# Altium schematic sheet PrimaryConverterSch-draft.SchDoc
size A3
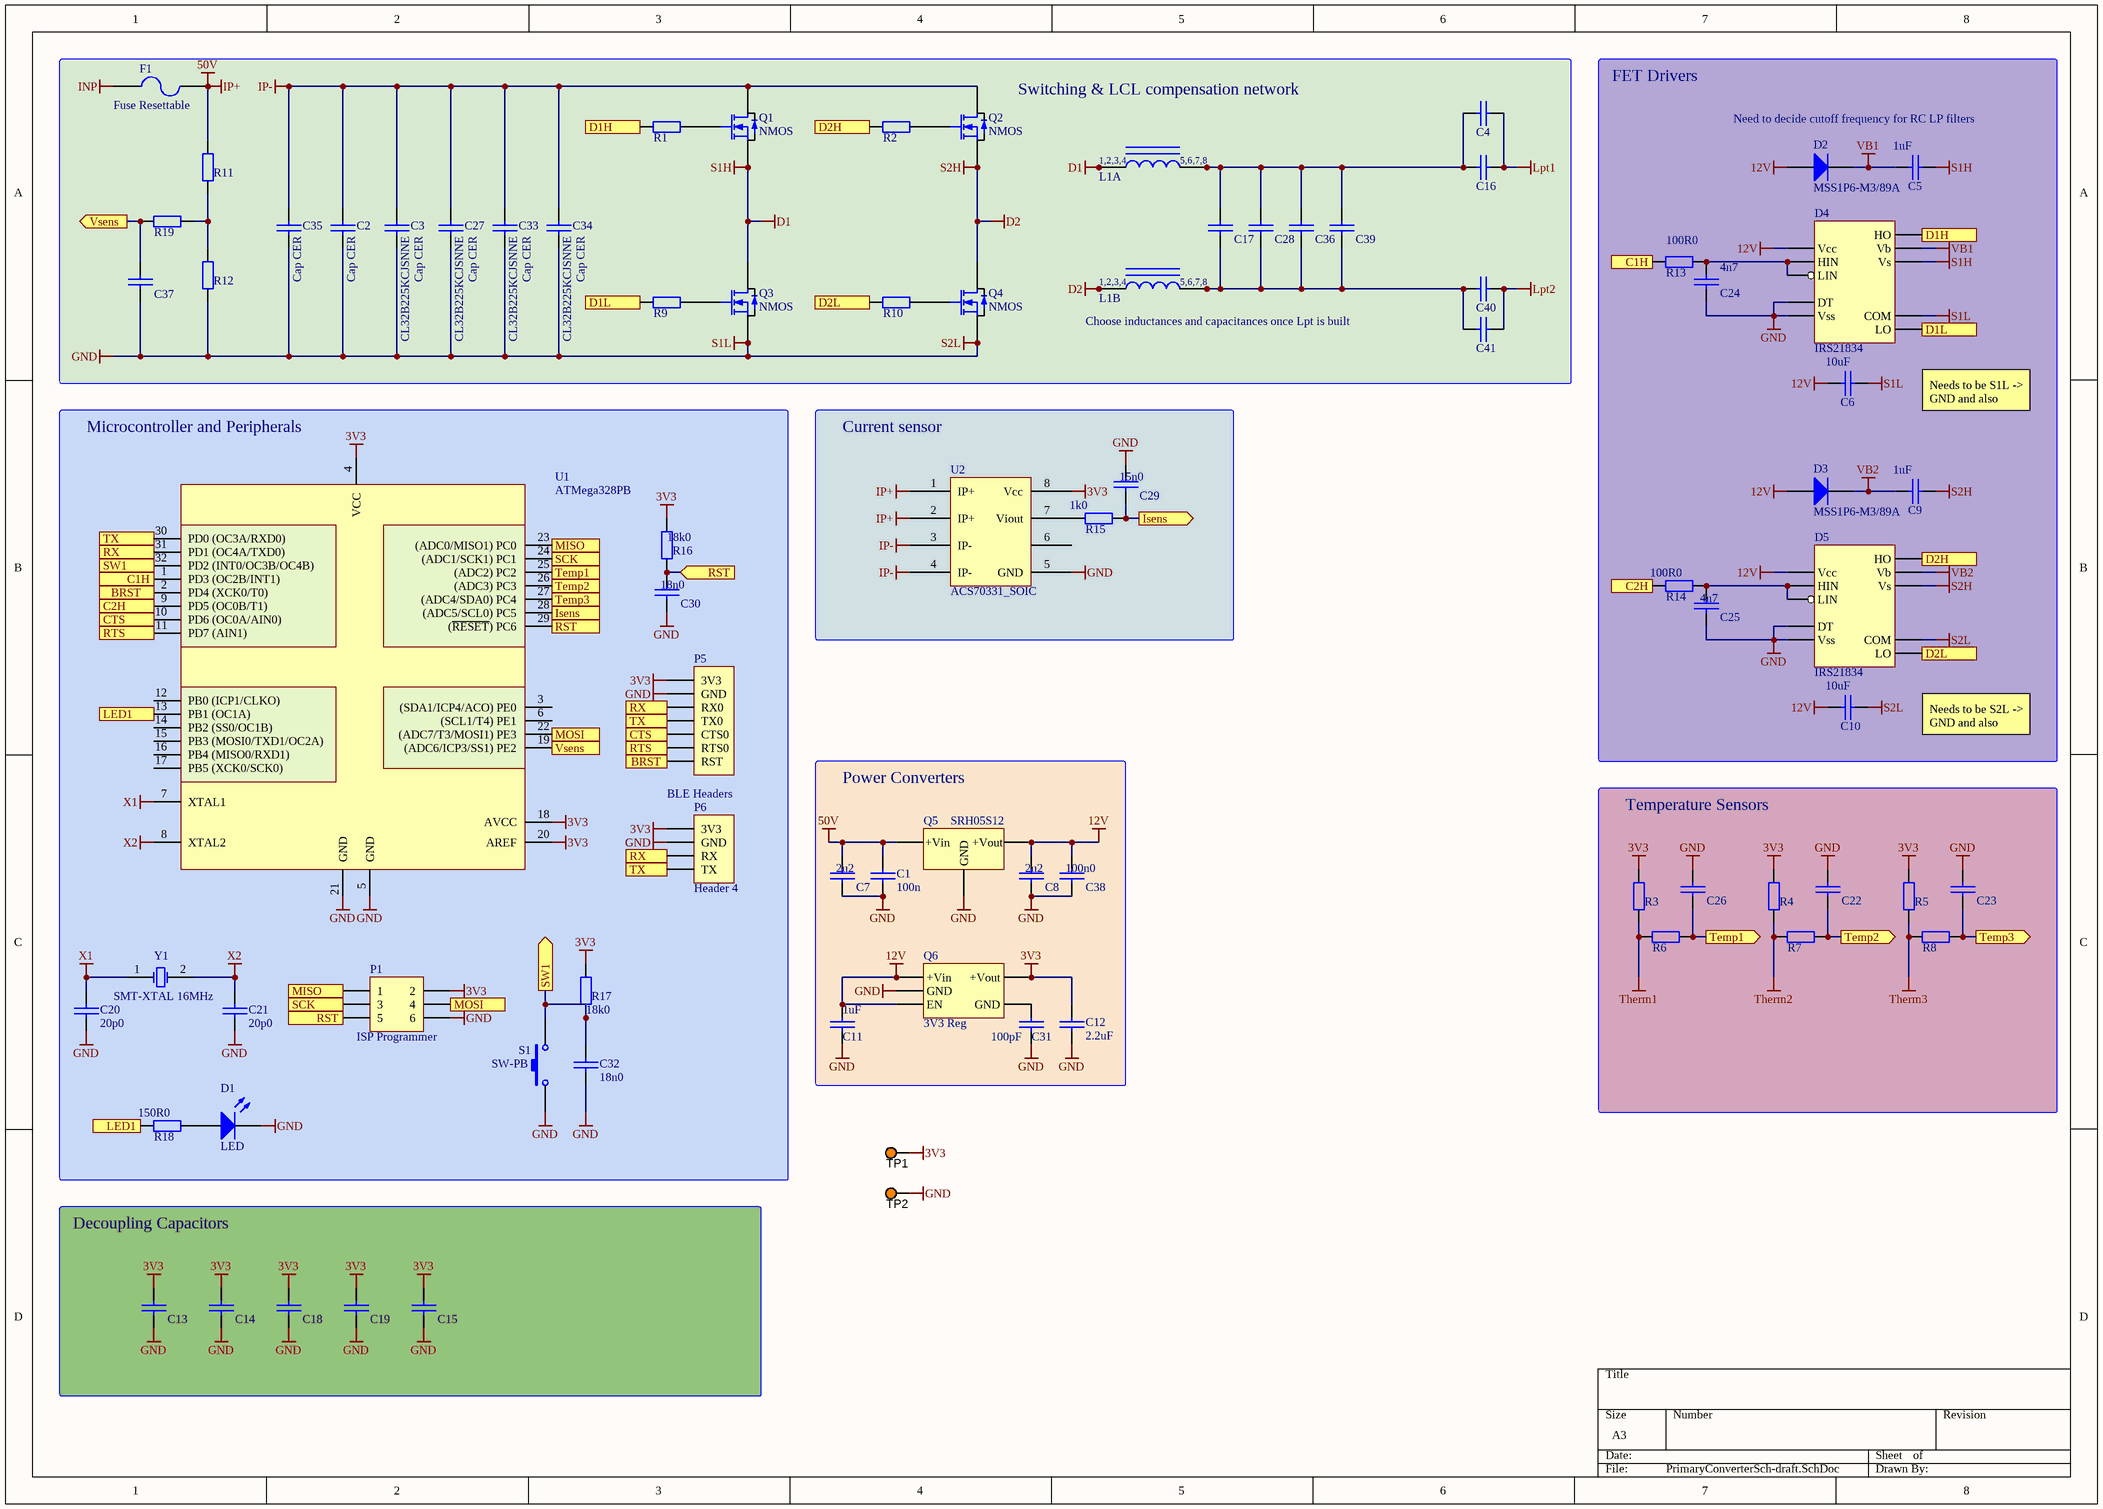
[diagram p0: PrimaryConverterSch-draft.SchDoc]

## Parts
C1  100n  [C1206]
C2  Cap CER  [C1206]
C3  Cap CER  Supplier Part Number 2: CL32B225KCJSNNE  [C1210]
C4  CCAP5750  [C5750]  (value not drawn)
C5  1uF  [C1210]
C6  10uF  [C1210]
C7  2u2  [C1210]
C8  2u2  [C1210]
C9  1uF  [C1210]
C10  10uF  [C1210]
C11  value 1uF  [C0805]  (hidden comment: Capacitor 0805)
C12  value 2.2uF  [C0805]  (hidden comment: Capacitor 0805)
C13  Capacitor 0805  [C0805]  (value not drawn)
C14  Capacitor 0805  [C0805]  (value not drawn)
C15  Capacitor 0805  [C0805]  (value not drawn)
C16  CCAP5750  [C5750]  (value not drawn)
C17  CCAP5750  [C5750]  (value not drawn)
C18  Capacitor 0805  [C0805]  (value not drawn)
C19  Capacitor 0805  [C0805]  (value not drawn)
C20  20p0  [C0805]
C21  20p0  [C0805]
C22  Capacitor 0805  [C0805]  (value not drawn)
C23  Capacitor 0805  [C0805]  (value not drawn)
C24  4n7  [C0805]
C25  4n7  [C0805]
C26  Capacitor 0805  [C0805]  (value not drawn)
C27  Cap CER  Supplier Part Number 2: CL32B225KCJSNNE  [C1210]
C28  CCAP5750  [C5750]  (value not drawn)
C29  15n0  [C0805]
C30  18n0  [C0805]
C31  value 100pF  [C0805]  (hidden comment: Capacitor 0805)
C32  18n0  [C0805]
C33  Cap CER  Supplier Part Number 2: CL32B225KCJSNNE  [C1210]
C34  Cap CER  Supplier Part Number 2: CL32B225KCJSNNE  [C1210]
C35  Cap CER  [C1206]
C36  CCAP5750  [C5750]  (value not drawn)
C37  Capacitor 0805  [C0805]  (value not drawn)
C38  100n0  [C0805]
C39  CCAP5750  [C5750]  (value not drawn)
C40  CCAP5750  [C5750]  (value not drawn)
C41  CCAP5750  [C5750]  (value not drawn)
D1  LED  [LED0805]
D2  MSS1P6-M3/89A  [MicroSMP (DO-219AD)]
D3  MSS1P6-M3/89A  [MicroSMP (DO-219AD)]
D4  IRS21834  [IRS21834]
D5  IRS21834  [IRS21834]
F1  Fuse Resettable  [0ZCF Series]
L1A  Inductor  [EFD20]  (value not drawn)
L1B  Inductor  [EFD20]  (value not drawn)
P1  ISP Programmer  [HDR2X3]
P5  BLE Headers  [HDR1X7]
P6  Header 4  [HDR1X4]
Q1  NMOS  [BSC072N08NS5ATMA1_modified_v2]
Q2  NMOS  [BSC072N08NS5ATMA1_modified_v2]
Q3  NMOS  [BSC072N08NS5ATMA1_modified_v2]
Q4  NMOS  [BSC072N08NS5ATMA1_modified_v2]
Q5  SRH05S12  [SRH05S12]
Q6  3V3 Reg  [3V3]
R1  Resistor 1206  [R1206]  (value not drawn)
R2  Resistor 1206  [R1206]  (value not drawn)
R3  Resistor 0805  [R0805]  (value not drawn)
R4  Resistor 0805  [R0805]  (value not drawn)
R5  Resistor 0805  [R0805]  (value not drawn)
R6  Resistor 0805  [R0805]  (value not drawn)
R7  Resistor 0805  [R0805]  (value not drawn)
R8  Resistor 0805  [R0805]  (value not drawn)
R9  Resistor 1206  [R1206]  (value not drawn)
R10  Resistor 1206  [R1206]  (value not drawn)
R11  Resistor 0805  [R0805]  (value not drawn)
R12  Resistor 0805  [R0805]  (value not drawn)
R13  100R0  [R0805]
R14  100R0  [R0805]
R15  1k0  [R0805]
R16  18k0  [R0805]
R17  18k0  [R0805]
R18  150R0  [R0805]
R19  Resistor 0805  [R0805]  (value not drawn)
S1  SW-PB  [SPST-2]
TP1  5003  [TP_TH]  (value not drawn)
TP2  5003  [TP_TH]  (value not drawn)
U1  ATMega328PB  [TQFP32]
U2  ACS70331_SOIC  [ACS70331]
Y1  SMT-XTAL 16MHz  [HC49-US]

## Blocks framed on the sheet
Switching & LCL compensation network: C2-C4 C16 C17 C27 C28 C33-C37 C39-C41 F1 L1A L1B Q1-Q4 R1 R2 R9-R12 R19
FET Drivers: C5 C6 C9 C10 C24 C25 D2-D5 R13 R14
Microcontroller and Peripherals: C20 C21 C30 C32 D1 P1 P5 P6 R16-R18 S1 U1 Y1
Current sensor: C29 R15 U2
Power Converters: C1 C7 C8 C11 C12 C31 C38 Q5 Q6
Temperature Sensors: C22 C23 C26 R3-R8
Decoupling Capacitors: C13-C15 C18 C19

## Ports
BRST (in), BRST (out), C1H (in), C1H (out), C2H (in), C2H (out), CTS (in), D1H (in), D1H (out), D1L (in), D1L (out), D2H (in), D2H (out), D2L (in), D2L (out), Isens (in), Isens (out), LED1 (in), MISO (in), MISO (out), MOSI (in), MOSI (out), RST (in), RST (out), RTS (out), RX (in), RX (out), SCK (in), SCK (out), SW1 (in), SW1 (out), Temp1 (in), Temp1 (out), Temp2 (in), Temp2 (out), Temp3 (in), Temp3 (out), TX (in), TX (out), Vsens (in), Vsens (out)

## Nets
3V3: C12.1 C13.2 C14.2 C15.2 C18.2 C19.2 P1.2 P5.1(3V3) P6.1(3V3) Q6.5(+Vout) R3.2 R4.2 R5.2 R16.2 R17.2 TP1.1 U1.4(VCC) U1.18(AVCC) U1.20(AREF) U2.8(Vcc)
12V: C6.2 C8.2 C10.2 C11.1 C38.2 D2.1(A) D3.1(A) D4.7(Vcc) D5.7(Vcc) Q5.2(+Vout) Q6.1(+Vin) Q6.3(EN)
50V: C1.2 C7.2 F1.2 Q5.0(+Vin) R11.2 U2.1(IP+) U2.2(IP+)  [also labelled IP+]
D1: C5.1 D4.11(Vs) L1A.1 L1A.2 L1A.3 L1A.4 Q1.1(S) Q3.8(D)  [also labelled S1H]
D2: C9.1 D5.11(Vs) L1B.1 L1B.2 L1B.3 L1B.4 Q2.1(S) Q4.8(D)  [also labelled S2H]
GND: C1.1 C2.1 C3.1 C6.1 C7.1 C8.1 C10.1 C11.2 C12.2 C13.1 C14.1 C15.1 C18.1 C19.1 C20.1 C21.1 C22.2 C23.2 C24.1 C25.1 C26.2 C27.1 C29.2 C30.1 C31.1 C32.1 C33.1 C34.1 C35.1 C37.2 C38.1 D1.2(K) D4.3(Vss) D4.4(DT) D4.5(COM) D5.3(Vss) D5.4(DT) D5.5(COM) P1.6 P5.2(GND) P6.2(GND) Q3.1(S) Q4.1(S) Q5.1(GND) Q6.2(GND) R12.1 S1.1 TP2.1 U1.5(GND) U1.21(GND) U2.5(GND)  [also labelled S1L, S2L]
INP: F1.1
IP-: C2.2 C3.2 C27.2 C33.2 C34.2 C35.2 Q1.8(D) Q2.8(D) U2.3(IP-) U2.4(IP-)
Lpt1: C4.1 C16.1
Lpt2: C40.1 C41.1
Therm1: R3.1 R6.2
Therm2: R4.1 R7.2
Therm3: R5.1 R8.2
VB1: C5.2 D2.2(K) D4.13(Vb)
VB2: C9.2 D3.2(K) D5.13(Vb)
X1: C20.2 U1.7(XTAL1) Y1.1(OSC1)
X2: C21.2 U1.8(XTAL2) Y1.2(OSC2)
BRST: P5.7(RST) U1.2(PD4_(XCK0/T0)) ; port BRST
C1H: R13.2 U1.1(PD3_(OC2B/INT1)) ; port C1H
C2H: R14.2 U1.9(PD5_(OC0B/T1)) ; port C2H
CTS: P5.5(CTS0) U1.10(PD6_(OC0A/AIN0)) ; port CTS
D1H: D4.12(HO) R1.1 ; port D1H
D1L: D4.6(LO) R9.1 ; port D1L
D2H: D5.12(HO) R2.1 ; port D2H
D2L: D5.6(LO) R10.1 ; port D2L
Isens: C29.1 R15.1 U1.28((ADC5/SCL0)_PC5) ; port Isens
LED1: R18.2 U1.13(PB1_(OC1A)) ; port LED1
MISO: P1.1 U1.23((ADC0/MISO1)_PC0) ; port MISO
MOSI: P1.4 U1.22((ADC7/T3/MOSI1)_PE3) ; port MOSI
RST: C30.2 P1.5 R16.1 U1.29((~{RESET})_PC6) ; port RST
RTS: P5.6(RTS0) U1.11(PD7_(AIN1)) ; port RTS
RX: P5.3(RX0) P6.3(RX) U1.31(PD1_(OC4A/TXD0)) ; port RX
SCK: P1.3 U1.24((ADC1/SCK1)_PC1) ; port SCK
SW1: C32.2 R17.1 S1.2 U1.32(PD2_(INT0/OC3B/OC4B)) ; port SW1
Temp1: C26.1 R6.1 U1.25((ADC2)_PC2) ; port Temp1
Temp2: C22.1 R7.1 U1.26((ADC3)_PC3) ; port Temp2
Temp3: C23.1 R8.1 U1.27((ADC4/SDA0)_PC4) ; port Temp3
TX: P5.4(TX0) P6.4(TX) U1.30(PD0_(OC3A/RXD0)) ; port TX
Vsens: C37.1 R19.2 U1.19((ADC6/ICP3/SS1)_PE2) ; port Vsens
NetC4_2: C4.2 C16.2 C17.2 C28.2 C36.2 C39.2 L1A.5 L1A.6 L1A.7 L1A.8
NetC17_1: C17.1 C28.1 C36.1 C39.1 C40.2 C41.2 L1B.5 L1B.6 L1B.7 L1B.8
NetC24_2: C24.2 D4.1(HIN) D4.2(LIN) R13.1
NetC25_2: C25.2 D5.1(HIN) D5.2(LIN) R14.1
NetC31_2: C31.2 Q6.4(GND)
NetD1_1: D1.1(A) R18.1
NetQ1_4: Q1.4(G) R1.2
NetQ2_4: Q2.4(G) R2.2
NetQ3_4: Q3.4(G) R9.2
NetQ4_4: Q4.4(G) R10.2
NetR11_1: R11.1 R12.2 R19.1
NetR15_2: R15.2 U2.7(Viout)

Not connected (* = marked no-connect by the designer): U1 3((SDA1/ICP4/ACO)_PE0) 6((SCL1/T4)_PE1) 12(PB0_(ICP1/CLKO)) 14(PB2_(SS0/OC1B)) 15(PB3_(MOSI0/TXD1/OC2A)) 16(PB4_(MISO0/RXD1)) 17(PB5_(XCK0/SCK0)); U2 6

## Notes on the sheet
- Need to decide cutoff frequency for RC LP filters
- (near L1B) Choose inductances and capacitances once Lpt is built
- Needs to be S1L -> GND and also require pull down on DT?
- Needs to be S2L -> GND and also require pull down on DT?
- (in symbol Inductor EFD20) 1,2,3,4; 5,6,7,8

## Library data of the parts
C1 = Cap CER Decoup C3216C0G2A104J160AC: CAP CER 0.1UF 100V C0G 1206; Manufacturer: TDK Corporation; Type: Surface mount; Supplier 1: RSComponents; Supplier Part Number 1: 1795799; MPN: C3216C0G2A104J160AC; Supplier 2: Element14; Part Description: CAP CER 0.1UF 100V C0G 1206; Value: 100n; Supplier Part Number 4: 810-C3216C0G2A104J6C; Supplier Part Number 3: 445-172677-1-ND; Supplier Part Number 2: 2906828; Supplier 4: Mouser; Supplier 3: Digi-Key
C2 C35 = Cap CER Decoup C3216C0G2A104J160AC: CAP CER 0.1UF 100V C0G 1206; Manufacturer: TDK Corporation; Type: Surface mount; Value: 100nF/100V; Supplier 1: RSComponents; Supplier Part Number 1: 1795799; MPN: C3216C0G2A104J160AC; Supplier 2: Element14; Part Description: CAP CER 0.1UF 100V C0G 1206; Supplier Part Number 4: 810-C3216C0G2A104J6C; Supplier Part Number 3: 445-172677-1-ND; Supplier Part Number 2: 2906828; Supplier 4: Mouser; Supplier 3: Digi-Key
C3 C27 C33 C34 = Cap CER HF DC-Link CL32B225KCJSNNE: CAP CER 2.2UF 100V X7R 1210; Manufacturer: AVX Corporation; Type: Surface mount; Value: 2200nF/100V; MPN: CL32B225KCJSNNE; Part Description: CAP CER 2.2UF 100V X7R 1210; Supplier 1: Digi-Key; Supplier Part Number 1: 1276-3362-1-ND; Supplier 2: Arrow
C4 C16 C17 C28 C36 C39-C41 = CCAP5750: CCAP1210
C5 C6 C9 C10 = CCAP1210: Type: Surface Mount; MPN: ?; Part Description: ?
  C5 C9: Value: 1uF
  C6 C10: Value: 10uF
C7 C8 = CCAP1210
C11-C15 C18-C26 C29-C32 = CCAP0805: Type: Surface Mount; MPN: ?; Part Description: ?
  C13-C15 C18 C19 C22 C23 C26: Value: ?
  C20 C21: Value: 20p0
  C24 C25: Value: 4n7
  C29: Value: 15n0
  C30 C32: Value: 18n0
C37 = CCAP0805: Type: Surface Mount; Value: 1uF; MPN: ?; Part Description: ?
C38 = CCAP0805
D1 = LED: Type: Surface Mount; Manufacturer: ?; MPN: ?; Package: ?
D2 D3 = Diode MSS1P6-M3/89A: DIODE SCHOTTKY 60V 1A MICROSMP; Manufacturer: Vishay Semiconductor Diodes Division; Type: Surface mount; MPN: MSS1P6-M3/89A; Supplier 1: RSComponents; Supplier 2: Element14; Part Description: DIODE SCHOTTKY 60V 1A MICROSMP; Supplier Part Number 2: 2335157; Supplier Part Number 1: 7103070P
D4 D5 = IRS21834: IRS21834 HALF-BRIDGE 600V FET DRIVER; ComponentLink1Description: Datasheet; ComponentLink1URL: https://www.infineon.com/dgdl/irs2183.pdf?fileId=5546d462533600a401535676d20c27d8
F1 = FuseResettable 0ZCF0100AF2A: PTC RESET FUSE 60V 1A 2920; Manufacturer: Bel Fuse Inc.; Type: Surface mount; Value: 60V/1A; MPN: 0ZCF0100AF2A; Part Description: PTC RESET FUSE 60V 1A 2920; Supplier Part Number 2: 530-0ZCF0100AF2A; Supplier Part Number 1: 507-2070-1-ND; Supplier 2: Mouser; Supplier 1: Digi-Key
L1A L1B = Inductor EFD20: Inductor with core
P1 = Header 3X2: Header, 3-Pin, Dual row; LatestRevisionDate: 17-Jul-2002; LatestRevisionNote: Re-released for DXP Platform.; Publisher: Altium Limited
P5 = Header 7: Header, 7-Pin; LatestRevisionDate: 17-Jul-2002; LatestRevisionNote: Re-released for DXP Platform.; Publisher: Altium Limited
P6 = Header 4: Header, 4-Pin; LatestRevisionDate: 17-Jul-2002; LatestRevisionNote: Re-released for DXP Platform.; Publisher: Altium Limited
Q1-Q4 = NMOS OptiMOS BSC072N08NS5ATMA1: MOSFET N-CH 80V 74A 8TDSON; Manufacturer: Infineon Technologies; Type: Surface mount; MPN: BSC072N08NS5ATMA1; Supplier 1: Element14; Part Description: MOSFET N-CH 80V 74A 8TDSON; Supplier Part Number 3: 726-BSC072N08NS5ATMA; Supplier Part Number 1: 2725812; Supplier 3: Mouser; Supplier Part Number 2: BSC072N08NS5ATMA1CT-ND; Supplier 2: Digi-Key
Q5 = SRH05S12: DC-DC Regulator 12V Out TH; ComponentLink1Description: Datasheet; ComponentLink1URL: https://www.xppower.com/portals/0/pdfs/SF_SRH05.pdf
R1 R2 R9 R10 = RES1206: MPN: ?; Type: Surface Mount; Value: ?; Part Description: ?
R3-R8 R11-R19 = RES0805: MPN: ?; Part Description: ?; Type: Surface Mount
  R3-R8 R11 R12 R19: Value: ?
  R13 R14: Value: 100R0
  R15: Value: 1k0
  R16 R17: Value: 18k0
  R18: Value: 150R0
S1 = SW-PB: Switch; Published: 24-Mar-1999; LatestRevisionDate: 17-Jul-2002; LatestRevisionNote: Re-released for DXP Platform.; PackageReference: SPST-2; Publisher: Altium Limited; PackageDescription: Switch; 2 Leads
TP1 TP2 = TestPoint: Test Point, Orange, 1-Pin THD, RoHS; Peak Reverse Current: 600 uA; Forward Current: 3 A; Max Surge Current: 80 A; Forward Voltage: 1.08 V; Max Operating Temperature: 150 degC; PackageReference: 5003; Pins: 2; ComponentLink2URL: http://keyelco.com/userAssets/file/M65p56.pdf; PackageDescription: 1-Pin Through Hole Device, Dia 2.54 mm; Weight: 0.01 lb; Diameter: 5.3 mm; Mount: Through Hole; Package Quantity: 500; Packaging: Bulk; Min Operating Temperature: -65 degC; ComponentLink1Description: Manufacturer URL; Height: 0.25 inch; ComponentLink1URL: http://www.keyelco.com/; ComponentLink2Description: Datasheet; Width: 0.25 inch; REACH SVHC: No SVHC; RoHSCompliant: true; Radiation Hardening: No; Length: 9.5 mm; DatasheetVersion: Jun-15
U1 = ATMega328PB: IC MCU 8BIT 32KB FLASH 32TQFP; Supplier 1: Digi-Key; Supplier Part Number 1: ATMEGA328PB-AU-ND; Supplier 2: Digikey; Supplier Part Number 2: ATMEGA328PB-AU-ND
U2 = ACS70331: 1MHz high sensitivity current sensor
Y1 = TXC9C-16_XTAL_SMT: 9C-16.000MAAJ-T crystal 16.0000MHZ 18PF SMD; Manufacturer: TXC CORPORATION; Frequency Stability: ±30ppm; Operating Mode: Fundamental; Supplier 1: Digi-Key; Manufacturer Part Number: 9C-16.000MAAJ-T; RoHS: RoHS Compliant; Category: Crystals, Oscillators, Resonators; Stock 1: 11514; Pricing 1: 1=0.75, 10=0.628, 50=0.5656, 100=0.5026, 500=0.47744 (NZD); Packaging: Cut Tape (CT); Part Status: Active; Type: MHz Crystal; Frequency Tolerance: ±30ppm; Load Capacitance: 18pF; Operating Temperature: -20°C ~ 70°C; Ratings: -; Mounting Type: Surface Mount; Package / Case: HC-49/US; Size / Dimension: 0.449" L x 0.189" W (11.40mm x 4.80mm); Height - Seated (Max): 0.161" (4.10mm); ComponentLink1URL: http://www.txccorp.com/download/products/quartz_crystals/2015TXC_9C_32.pdf; ComponentLink1Description: http://www.txccorp.com/download/products/quartz_crystals/2015TXC_9C_32.pdf; Supplier Part Number 1: 887-1059-1-ND